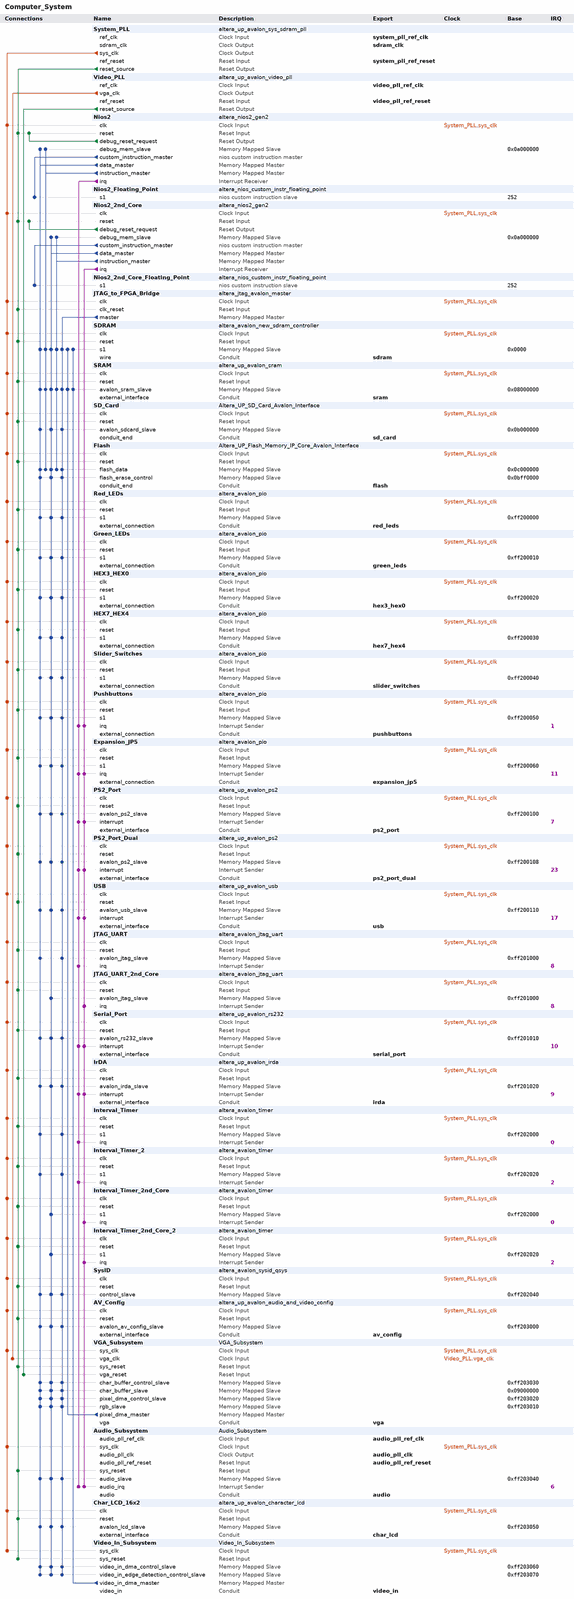
[diagram p0: system contents, whole]
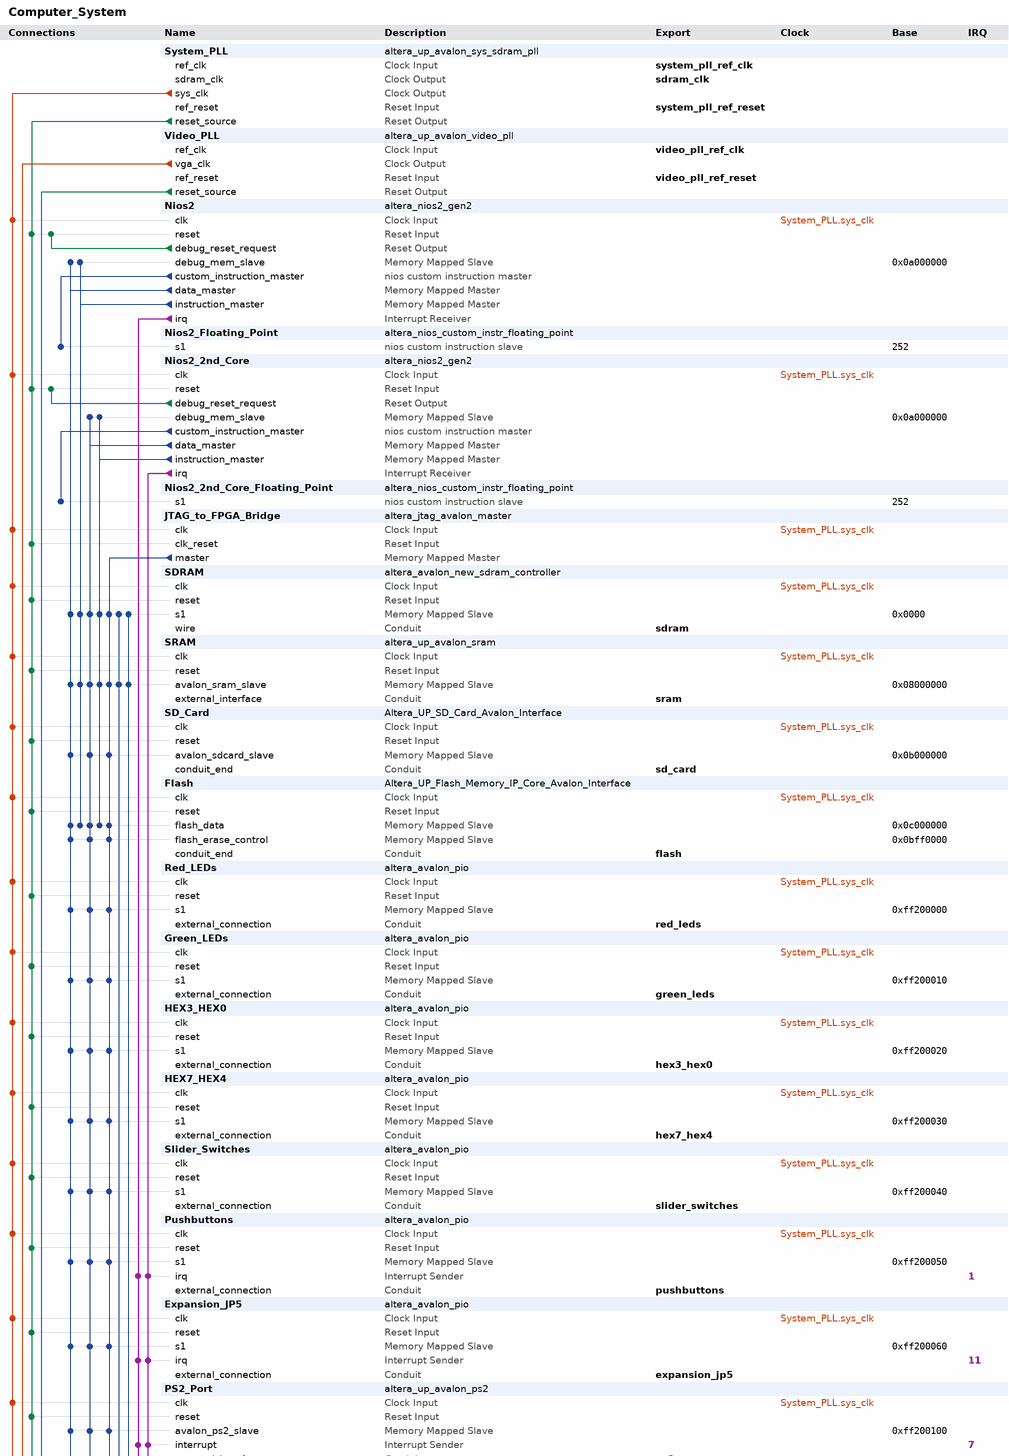
[diagram p1: system contents, upper part]
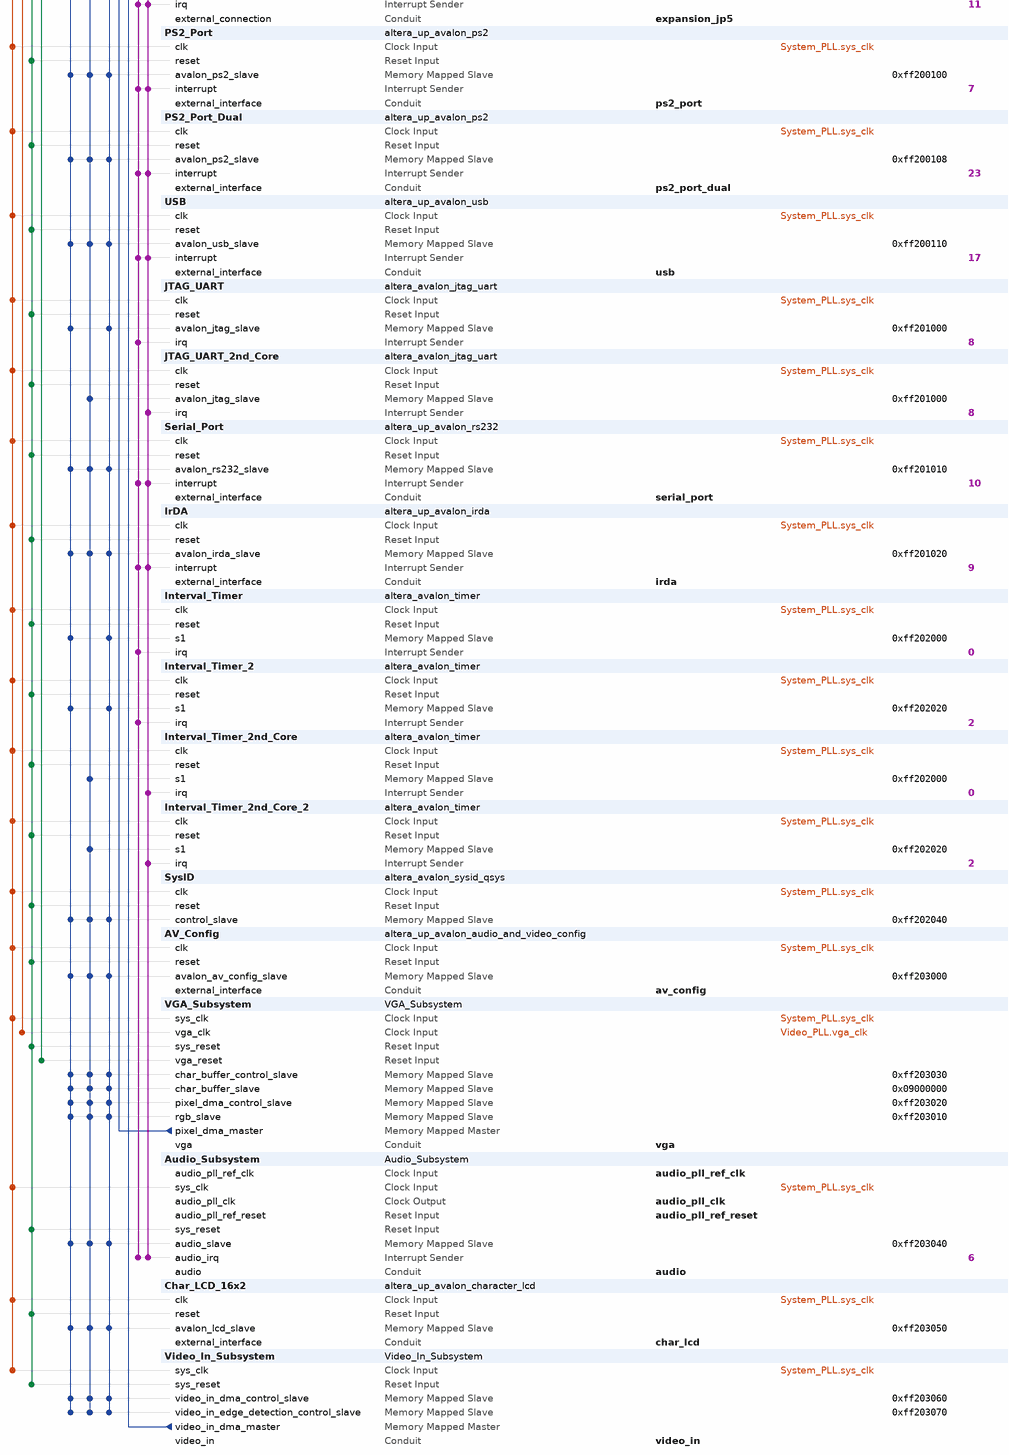
[diagram p2: system contents, lower part]
# Platform Designer (Qsys) system Computer_System, Cyclone IV E EP4CE115F29C8
# Parameters at their usual value, and those the tool derives, are not listed.
package require -exact qsys 18.0
create_system Computer_System
set_project_property DEVICE_FAMILY {Cyclone IV E}
set_project_property DEVICE EP4CE115F29C8

add_instance System_PLL altera_up_avalon_sys_sdram_pll 18.0
set_instance_parameter_value System_PLL CV_boards DE10-Standard
set_instance_parameter_value System_PLL gui_outclk 50.0
set_instance_parameter_value System_PLL gui_refclk 50.0

add_instance Video_PLL altera_up_avalon_video_pll 18.0
set_instance_parameter_value Video_PLL camera {5MP Digital Camera (THDB_D5M)}
set_instance_parameter_value Video_PLL gui_refclk 50.0
set_instance_parameter_value Video_PLL lcd {7" LCD on VEEK-MT and MTL/MTL2 Modules}

add_instance Nios2 altera_nios2_gen2 18.0
set_instance_parameter_value Nios2 dcache_size 0
set_instance_parameter_value Nios2 debug_datatrigger 2
set_instance_parameter_value Nios2 debug_hwbreakpoint 2
set_instance_parameter_value Nios2 debug_traceType instruction_trace
set_instance_parameter_value Nios2 dividerType srt2
set_instance_parameter_value Nios2 exceptionSlave SDRAM.s1
set_instance_parameter_value Nios2 icache_size 4096
set_instance_parameter_value Nios2 impl Fast
set_instance_parameter_value Nios2 mul_64_impl 1
set_instance_parameter_value Nios2 mul_shift_choice 1
set_instance_parameter_value Nios2 resetSlave SDRAM.s1
set_instance_parameter_value Nios2 resetrequest_enabled false
set_instance_parameter_value Nios2 setting_support31bitdcachebypass false

add_instance Nios2_Floating_Point altera_nios_custom_instr_floating_point 18.0

add_instance Nios2_2nd_Core altera_nios2_gen2 18.0
set_instance_parameter_value Nios2_2nd_Core cpuID 1
set_instance_parameter_value Nios2_2nd_Core dcache_size 0
set_instance_parameter_value Nios2_2nd_Core debug_datatrigger 2
set_instance_parameter_value Nios2_2nd_Core debug_hwbreakpoint 2
set_instance_parameter_value Nios2_2nd_Core debug_traceType instruction_trace
set_instance_parameter_value Nios2_2nd_Core dividerType srt2
set_instance_parameter_value Nios2_2nd_Core exceptionOffset 67108896
set_instance_parameter_value Nios2_2nd_Core exceptionSlave SDRAM.s1
set_instance_parameter_value Nios2_2nd_Core icache_size 4096
set_instance_parameter_value Nios2_2nd_Core impl Fast
set_instance_parameter_value Nios2_2nd_Core mul_64_impl 1
set_instance_parameter_value Nios2_2nd_Core mul_shift_choice 1
set_instance_parameter_value Nios2_2nd_Core resetOffset 67108864
set_instance_parameter_value Nios2_2nd_Core resetSlave SDRAM.s1
set_instance_parameter_value Nios2_2nd_Core resetrequest_enabled false
set_instance_parameter_value Nios2_2nd_Core setting_support31bitdcachebypass false

add_instance Nios2_2nd_Core_Floating_Point altera_nios_custom_instr_floating_point 18.0

add_instance JTAG_to_FPGA_Bridge altera_jtag_avalon_master 18.0

add_instance SDRAM altera_avalon_new_sdram_controller 18.0
set_instance_parameter_value SDRAM TAC 5.5
set_instance_parameter_value SDRAM TRCD 20.0
set_instance_parameter_value SDRAM TRP 20.0
set_instance_parameter_value SDRAM casLatency 3
set_instance_parameter_value SDRAM columnWidth 10
set_instance_parameter_value SDRAM dataWidth 32
set_instance_parameter_value SDRAM generateSimulationModel true
set_instance_parameter_value SDRAM model single_Micron_MT48LC4M32B2_7_chip
set_instance_parameter_value SDRAM numberOfBanks 4
set_instance_parameter_value SDRAM numberOfChipSelects 1
set_instance_parameter_value SDRAM powerUpDelay 100.0
set_instance_parameter_value SDRAM refreshPeriod 15.625
set_instance_parameter_value SDRAM rowWidth 13

add_instance SRAM altera_up_avalon_sram 18.0
set_instance_parameter_value SRAM board DE2-115
set_instance_parameter_value SRAM pixel_buffer true

add_instance SD_Card Altera_UP_SD_Card_Avalon_Interface 18.0

add_instance Flash Altera_UP_Flash_Memory_IP_Core_Avalon_Interface 18.0
set_instance_parameter_value Flash FLASH_MEMORY_ADDRESS_WIDTH 23

add_instance Red_LEDs altera_avalon_pio 18.0
set_instance_parameter_value Red_LEDs direction Output
set_instance_parameter_value Red_LEDs width 18

add_instance Green_LEDs altera_avalon_pio 18.0
set_instance_parameter_value Green_LEDs direction Output
set_instance_parameter_value Green_LEDs width 9

add_instance HEX3_HEX0 altera_avalon_pio 18.0
set_instance_parameter_value HEX3_HEX0 direction Output
set_instance_parameter_value HEX3_HEX0 width 32

add_instance HEX7_HEX4 altera_avalon_pio 18.0
set_instance_parameter_value HEX7_HEX4 direction Output
set_instance_parameter_value HEX7_HEX4 width 32

add_instance Slider_Switches altera_avalon_pio 18.0
set_instance_parameter_value Slider_Switches direction Input
set_instance_parameter_value Slider_Switches simDoTestBenchWiring true
set_instance_parameter_value Slider_Switches width 18

add_instance Pushbuttons altera_avalon_pio 18.0
set_instance_parameter_value Pushbuttons bitClearingEdgeCapReg true
set_instance_parameter_value Pushbuttons captureEdge true
set_instance_parameter_value Pushbuttons direction Input
set_instance_parameter_value Pushbuttons edgeType FALLING
set_instance_parameter_value Pushbuttons generateIRQ true
set_instance_parameter_value Pushbuttons irqType EDGE
set_instance_parameter_value Pushbuttons simDoTestBenchWiring true
set_instance_parameter_value Pushbuttons width 4

add_instance Expansion_JP5 altera_avalon_pio 18.0
set_instance_parameter_value Expansion_JP5 bitClearingEdgeCapReg true
set_instance_parameter_value Expansion_JP5 captureEdge true
set_instance_parameter_value Expansion_JP5 direction Bidir
set_instance_parameter_value Expansion_JP5 edgeType FALLING
set_instance_parameter_value Expansion_JP5 generateIRQ true
set_instance_parameter_value Expansion_JP5 irqType EDGE
set_instance_parameter_value Expansion_JP5 simDoTestBenchWiring true
set_instance_parameter_value Expansion_JP5 width 32

add_instance PS2_Port altera_up_avalon_ps2 18.0

add_instance PS2_Port_Dual altera_up_avalon_ps2 18.0

add_instance USB altera_up_avalon_usb 18.0

add_instance JTAG_UART altera_avalon_jtag_uart 18.0
set_instance_parameter_value JTAG_UART simInteractiveOptions NO_INTERACTIVE_WINDOWS

add_instance JTAG_UART_2nd_Core altera_avalon_jtag_uart 18.0
set_instance_parameter_value JTAG_UART_2nd_Core simInteractiveOptions NO_INTERACTIVE_WINDOWS

add_instance Serial_Port altera_up_avalon_rs232 17.1
set_instance_parameter_value Serial_Port baud 115200
set_instance_parameter_value Serial_Port parity Odd

add_instance IrDA altera_up_avalon_irda 18.0
set_instance_parameter_value IrDA baud 115200
set_instance_parameter_value IrDA parity None

add_instance Interval_Timer altera_avalon_timer 18.0
set_instance_parameter_value Interval_Timer period 125.0
set_instance_parameter_value Interval_Timer periodUnits MSEC

add_instance Interval_Timer_2 altera_avalon_timer 18.0
set_instance_parameter_value Interval_Timer_2 period 125.0
set_instance_parameter_value Interval_Timer_2 periodUnits MSEC

add_instance Interval_Timer_2nd_Core altera_avalon_timer 18.0
set_instance_parameter_value Interval_Timer_2nd_Core period 125.0
set_instance_parameter_value Interval_Timer_2nd_Core periodUnits MSEC

add_instance Interval_Timer_2nd_Core_2 altera_avalon_timer 18.0
set_instance_parameter_value Interval_Timer_2nd_Core_2 period 125.0
set_instance_parameter_value Interval_Timer_2nd_Core_2 periodUnits MSEC

add_instance SysID altera_avalon_sysid_qsys 18.0
set_instance_parameter_value SysID id 0

add_instance AV_Config altera_up_avalon_audio_and_video_config 18.0
set_instance_parameter_value AV_Config audio_in {Microphone to ADC}
set_instance_parameter_value AV_Config bit_length 32
set_instance_parameter_value AV_Config board DE2-115
set_instance_parameter_value AV_Config line_in_bypass true
set_instance_parameter_value AV_Config sampling_rate {8 kHz}

add_instance VGA_Subsystem VGA_Subsystem 1.0

add_instance Audio_Subsystem Audio_Subsystem 1.0

add_instance Char_LCD_16x2 altera_up_avalon_character_lcd 18.0
set_instance_parameter_value Char_LCD_16x2 cursor Both

add_instance Video_In_Subsystem Video_In_Subsystem 1.0

# connections
add_connection System_PLL.sys_clk Audio_Subsystem.sys_clk clock
add_connection System_PLL.sys_clk AV_Config.clk clock
add_connection System_PLL.sys_clk Char_LCD_16x2.clk clock
add_connection System_PLL.sys_clk Expansion_JP5.clk clock
add_connection System_PLL.sys_clk Flash.clk clock
add_connection System_PLL.sys_clk Green_LEDs.clk clock
add_connection System_PLL.sys_clk HEX3_HEX0.clk clock
add_connection System_PLL.sys_clk HEX7_HEX4.clk clock
add_connection System_PLL.sys_clk Interval_Timer.clk clock
add_connection System_PLL.sys_clk Interval_Timer_2.clk clock
add_connection System_PLL.sys_clk Interval_Timer_2nd_Core.clk clock
add_connection System_PLL.sys_clk Interval_Timer_2nd_Core_2.clk clock
add_connection System_PLL.sys_clk IrDA.clk clock
add_connection System_PLL.sys_clk JTAG_to_FPGA_Bridge.clk clock
add_connection System_PLL.sys_clk JTAG_UART.clk clock
add_connection System_PLL.sys_clk JTAG_UART_2nd_Core.clk clock
add_connection System_PLL.sys_clk Nios2.clk clock
add_connection System_PLL.sys_clk Nios2_2nd_Core.clk clock
add_connection System_PLL.sys_clk PS2_Port.clk clock
add_connection System_PLL.sys_clk PS2_Port_Dual.clk clock
add_connection System_PLL.sys_clk Pushbuttons.clk clock
add_connection System_PLL.sys_clk Red_LEDs.clk clock
add_connection System_PLL.sys_clk SD_Card.clk clock
add_connection System_PLL.sys_clk SDRAM.clk clock
add_connection System_PLL.sys_clk Serial_Port.clk clock
add_connection System_PLL.sys_clk Slider_Switches.clk clock
add_connection System_PLL.sys_clk SRAM.clk clock
add_connection System_PLL.sys_clk SysID.clk clock
add_connection System_PLL.sys_clk USB.clk clock
add_connection System_PLL.sys_clk VGA_Subsystem.sys_clk clock
add_connection System_PLL.sys_clk Video_In_Subsystem.sys_clk clock
add_connection Video_PLL.vga_clk VGA_Subsystem.vga_clk clock
add_connection Nios2.debug_reset_request Nios2.reset reset
add_connection Nios2_2nd_Core.debug_reset_request Nios2_2nd_Core.reset reset
add_connection System_PLL.reset_source Audio_Subsystem.sys_reset reset
add_connection System_PLL.reset_source AV_Config.reset reset
add_connection System_PLL.reset_source Char_LCD_16x2.reset reset
add_connection System_PLL.reset_source Expansion_JP5.reset reset
add_connection System_PLL.reset_source Flash.reset reset
add_connection System_PLL.reset_source Green_LEDs.reset reset
add_connection System_PLL.reset_source HEX3_HEX0.reset reset
add_connection System_PLL.reset_source HEX7_HEX4.reset reset
add_connection System_PLL.reset_source Interval_Timer.reset reset
add_connection System_PLL.reset_source Interval_Timer_2.reset reset
add_connection System_PLL.reset_source Interval_Timer_2nd_Core.reset reset
add_connection System_PLL.reset_source Interval_Timer_2nd_Core_2.reset reset
add_connection System_PLL.reset_source IrDA.reset reset
add_connection System_PLL.reset_source JTAG_to_FPGA_Bridge.clk_reset reset
add_connection System_PLL.reset_source JTAG_UART.reset reset
add_connection System_PLL.reset_source JTAG_UART_2nd_Core.reset reset
add_connection System_PLL.reset_source Nios2.reset reset
add_connection System_PLL.reset_source Nios2_2nd_Core.reset reset
add_connection System_PLL.reset_source PS2_Port.reset reset
add_connection System_PLL.reset_source PS2_Port_Dual.reset reset
add_connection System_PLL.reset_source Pushbuttons.reset reset
add_connection System_PLL.reset_source Red_LEDs.reset reset
add_connection System_PLL.reset_source SD_Card.reset reset
add_connection System_PLL.reset_source SDRAM.reset reset
add_connection System_PLL.reset_source Serial_Port.reset reset
add_connection System_PLL.reset_source Slider_Switches.reset reset
add_connection System_PLL.reset_source SRAM.reset reset
add_connection System_PLL.reset_source SysID.reset reset
add_connection System_PLL.reset_source USB.reset reset
add_connection System_PLL.reset_source VGA_Subsystem.sys_reset reset
add_connection System_PLL.reset_source Video_In_Subsystem.sys_reset reset
add_connection Video_PLL.reset_source VGA_Subsystem.vga_reset reset
add_connection JTAG_to_FPGA_Bridge.master Audio_Subsystem.audio_slave avalon
set_connection_parameter_value JTAG_to_FPGA_Bridge.master/Audio_Subsystem.audio_slave baseAddress 0xff203040
add_connection JTAG_to_FPGA_Bridge.master AV_Config.avalon_av_config_slave avalon
set_connection_parameter_value JTAG_to_FPGA_Bridge.master/AV_Config.avalon_av_config_slave baseAddress 0xff203000
add_connection JTAG_to_FPGA_Bridge.master Char_LCD_16x2.avalon_lcd_slave avalon
set_connection_parameter_value JTAG_to_FPGA_Bridge.master/Char_LCD_16x2.avalon_lcd_slave baseAddress 0xff203050
add_connection JTAG_to_FPGA_Bridge.master Expansion_JP5.s1 avalon
set_connection_parameter_value JTAG_to_FPGA_Bridge.master/Expansion_JP5.s1 baseAddress 0xff200060
add_connection JTAG_to_FPGA_Bridge.master Flash.flash_data avalon
set_connection_parameter_value JTAG_to_FPGA_Bridge.master/Flash.flash_data baseAddress 0x0c000000
add_connection JTAG_to_FPGA_Bridge.master Flash.flash_erase_control avalon
set_connection_parameter_value JTAG_to_FPGA_Bridge.master/Flash.flash_erase_control baseAddress 0x0bff0000
add_connection JTAG_to_FPGA_Bridge.master Green_LEDs.s1 avalon
set_connection_parameter_value JTAG_to_FPGA_Bridge.master/Green_LEDs.s1 baseAddress 0xff200010
add_connection JTAG_to_FPGA_Bridge.master HEX3_HEX0.s1 avalon
set_connection_parameter_value JTAG_to_FPGA_Bridge.master/HEX3_HEX0.s1 baseAddress 0xff200020
add_connection JTAG_to_FPGA_Bridge.master HEX7_HEX4.s1 avalon
set_connection_parameter_value JTAG_to_FPGA_Bridge.master/HEX7_HEX4.s1 baseAddress 0xff200030
add_connection JTAG_to_FPGA_Bridge.master Interval_Timer.s1 avalon
set_connection_parameter_value JTAG_to_FPGA_Bridge.master/Interval_Timer.s1 baseAddress 0xff202000
add_connection JTAG_to_FPGA_Bridge.master Interval_Timer_2.s1 avalon
set_connection_parameter_value JTAG_to_FPGA_Bridge.master/Interval_Timer_2.s1 baseAddress 0xff202020
add_connection JTAG_to_FPGA_Bridge.master IrDA.avalon_irda_slave avalon
set_connection_parameter_value JTAG_to_FPGA_Bridge.master/IrDA.avalon_irda_slave baseAddress 0xff201020
add_connection JTAG_to_FPGA_Bridge.master JTAG_UART.avalon_jtag_slave avalon
set_connection_parameter_value JTAG_to_FPGA_Bridge.master/JTAG_UART.avalon_jtag_slave baseAddress 0xff201000
add_connection JTAG_to_FPGA_Bridge.master PS2_Port.avalon_ps2_slave avalon
set_connection_parameter_value JTAG_to_FPGA_Bridge.master/PS2_Port.avalon_ps2_slave baseAddress 0xff200100
add_connection JTAG_to_FPGA_Bridge.master PS2_Port_Dual.avalon_ps2_slave avalon
set_connection_parameter_value JTAG_to_FPGA_Bridge.master/PS2_Port_Dual.avalon_ps2_slave baseAddress 0xff200108
add_connection JTAG_to_FPGA_Bridge.master Pushbuttons.s1 avalon
set_connection_parameter_value JTAG_to_FPGA_Bridge.master/Pushbuttons.s1 baseAddress 0xff200050
add_connection JTAG_to_FPGA_Bridge.master Red_LEDs.s1 avalon
set_connection_parameter_value JTAG_to_FPGA_Bridge.master/Red_LEDs.s1 baseAddress 0xff200000
add_connection JTAG_to_FPGA_Bridge.master SD_Card.avalon_sdcard_slave avalon
set_connection_parameter_value JTAG_to_FPGA_Bridge.master/SD_Card.avalon_sdcard_slave baseAddress 0x0b000000
add_connection JTAG_to_FPGA_Bridge.master SDRAM.s1 avalon
set_connection_parameter_value JTAG_to_FPGA_Bridge.master/SDRAM.s1 baseAddress 0x0000
add_connection JTAG_to_FPGA_Bridge.master Serial_Port.avalon_rs232_slave avalon
set_connection_parameter_value JTAG_to_FPGA_Bridge.master/Serial_Port.avalon_rs232_slave baseAddress 0xff201010
add_connection JTAG_to_FPGA_Bridge.master Slider_Switches.s1 avalon
set_connection_parameter_value JTAG_to_FPGA_Bridge.master/Slider_Switches.s1 baseAddress 0xff200040
add_connection JTAG_to_FPGA_Bridge.master SRAM.avalon_sram_slave avalon
set_connection_parameter_value JTAG_to_FPGA_Bridge.master/SRAM.avalon_sram_slave baseAddress 0x08000000
add_connection JTAG_to_FPGA_Bridge.master SysID.control_slave avalon
set_connection_parameter_value JTAG_to_FPGA_Bridge.master/SysID.control_slave baseAddress 0xff202040
add_connection JTAG_to_FPGA_Bridge.master USB.avalon_usb_slave avalon
set_connection_parameter_value JTAG_to_FPGA_Bridge.master/USB.avalon_usb_slave baseAddress 0xff200110
add_connection JTAG_to_FPGA_Bridge.master VGA_Subsystem.char_buffer_control_slave avalon
set_connection_parameter_value JTAG_to_FPGA_Bridge.master/VGA_Subsystem.char_buffer_control_slave baseAddress 0xff203030
add_connection JTAG_to_FPGA_Bridge.master VGA_Subsystem.char_buffer_slave avalon
set_connection_parameter_value JTAG_to_FPGA_Bridge.master/VGA_Subsystem.char_buffer_slave baseAddress 0x09000000
add_connection JTAG_to_FPGA_Bridge.master VGA_Subsystem.pixel_dma_control_slave avalon
set_connection_parameter_value JTAG_to_FPGA_Bridge.master/VGA_Subsystem.pixel_dma_control_slave baseAddress 0xff203020
add_connection JTAG_to_FPGA_Bridge.master VGA_Subsystem.rgb_slave avalon
set_connection_parameter_value JTAG_to_FPGA_Bridge.master/VGA_Subsystem.rgb_slave baseAddress 0xff203010
add_connection JTAG_to_FPGA_Bridge.master Video_In_Subsystem.video_in_dma_control_slave avalon
set_connection_parameter_value JTAG_to_FPGA_Bridge.master/Video_In_Subsystem.video_in_dma_control_slave baseAddress 0xff203060
add_connection JTAG_to_FPGA_Bridge.master Video_In_Subsystem.video_in_edge_detection_control_slave avalon
set_connection_parameter_value JTAG_to_FPGA_Bridge.master/Video_In_Subsystem.video_in_edge_detection_control_slave baseAddress 0xff203070
add_connection Nios2.data_master Audio_Subsystem.audio_slave avalon
set_connection_parameter_value Nios2.data_master/Audio_Subsystem.audio_slave baseAddress 0xff203040
add_connection Nios2.data_master AV_Config.avalon_av_config_slave avalon
set_connection_parameter_value Nios2.data_master/AV_Config.avalon_av_config_slave baseAddress 0xff203000
add_connection Nios2.data_master Char_LCD_16x2.avalon_lcd_slave avalon
set_connection_parameter_value Nios2.data_master/Char_LCD_16x2.avalon_lcd_slave baseAddress 0xff203050
add_connection Nios2.data_master Expansion_JP5.s1 avalon
set_connection_parameter_value Nios2.data_master/Expansion_JP5.s1 baseAddress 0xff200060
add_connection Nios2.data_master Flash.flash_data avalon
set_connection_parameter_value Nios2.data_master/Flash.flash_data baseAddress 0x0c000000
add_connection Nios2.data_master Flash.flash_erase_control avalon
set_connection_parameter_value Nios2.data_master/Flash.flash_erase_control baseAddress 0x0bff0000
add_connection Nios2.data_master Green_LEDs.s1 avalon
set_connection_parameter_value Nios2.data_master/Green_LEDs.s1 baseAddress 0xff200010
add_connection Nios2.data_master HEX3_HEX0.s1 avalon
set_connection_parameter_value Nios2.data_master/HEX3_HEX0.s1 baseAddress 0xff200020
add_connection Nios2.data_master HEX7_HEX4.s1 avalon
set_connection_parameter_value Nios2.data_master/HEX7_HEX4.s1 baseAddress 0xff200030
add_connection Nios2.data_master Interval_Timer.s1 avalon
set_connection_parameter_value Nios2.data_master/Interval_Timer.s1 baseAddress 0xff202000
add_connection Nios2.data_master Interval_Timer_2.s1 avalon
set_connection_parameter_value Nios2.data_master/Interval_Timer_2.s1 baseAddress 0xff202020
add_connection Nios2.data_master IrDA.avalon_irda_slave avalon
set_connection_parameter_value Nios2.data_master/IrDA.avalon_irda_slave baseAddress 0xff201020
add_connection Nios2.data_master JTAG_UART.avalon_jtag_slave avalon
set_connection_parameter_value Nios2.data_master/JTAG_UART.avalon_jtag_slave baseAddress 0xff201000
add_connection Nios2.data_master Nios2.debug_mem_slave avalon
set_connection_parameter_value Nios2.data_master/Nios2.debug_mem_slave baseAddress 0x0a000000
add_connection Nios2.data_master PS2_Port.avalon_ps2_slave avalon
set_connection_parameter_value Nios2.data_master/PS2_Port.avalon_ps2_slave baseAddress 0xff200100
add_connection Nios2.data_master PS2_Port_Dual.avalon_ps2_slave avalon
set_connection_parameter_value Nios2.data_master/PS2_Port_Dual.avalon_ps2_slave baseAddress 0xff200108
add_connection Nios2.data_master Pushbuttons.s1 avalon
set_connection_parameter_value Nios2.data_master/Pushbuttons.s1 baseAddress 0xff200050
add_connection Nios2.data_master Red_LEDs.s1 avalon
set_connection_parameter_value Nios2.data_master/Red_LEDs.s1 baseAddress 0xff200000
add_connection Nios2.data_master SD_Card.avalon_sdcard_slave avalon
set_connection_parameter_value Nios2.data_master/SD_Card.avalon_sdcard_slave baseAddress 0x0b000000
add_connection Nios2.data_master SDRAM.s1 avalon
set_connection_parameter_value Nios2.data_master/SDRAM.s1 baseAddress 0x0000
add_connection Nios2.data_master Serial_Port.avalon_rs232_slave avalon
set_connection_parameter_value Nios2.data_master/Serial_Port.avalon_rs232_slave baseAddress 0xff201010
add_connection Nios2.data_master Slider_Switches.s1 avalon
set_connection_parameter_value Nios2.data_master/Slider_Switches.s1 baseAddress 0xff200040
add_connection Nios2.data_master SRAM.avalon_sram_slave avalon
set_connection_parameter_value Nios2.data_master/SRAM.avalon_sram_slave baseAddress 0x08000000
add_connection Nios2.data_master SysID.control_slave avalon
set_connection_parameter_value Nios2.data_master/SysID.control_slave baseAddress 0xff202040
add_connection Nios2.data_master USB.avalon_usb_slave avalon
set_connection_parameter_value Nios2.data_master/USB.avalon_usb_slave baseAddress 0xff200110
add_connection Nios2.data_master VGA_Subsystem.char_buffer_control_slave avalon
set_connection_parameter_value Nios2.data_master/VGA_Subsystem.char_buffer_control_slave baseAddress 0xff203030
add_connection Nios2.data_master VGA_Subsystem.char_buffer_slave avalon
set_connection_parameter_value Nios2.data_master/VGA_Subsystem.char_buffer_slave baseAddress 0x09000000
add_connection Nios2.data_master VGA_Subsystem.pixel_dma_control_slave avalon
set_connection_parameter_value Nios2.data_master/VGA_Subsystem.pixel_dma_control_slave baseAddress 0xff203020
add_connection Nios2.data_master VGA_Subsystem.rgb_slave avalon
set_connection_parameter_value Nios2.data_master/VGA_Subsystem.rgb_slave baseAddress 0xff203010
add_connection Nios2.data_master Video_In_Subsystem.video_in_dma_control_slave avalon
set_connection_parameter_value Nios2.data_master/Video_In_Subsystem.video_in_dma_control_slave baseAddress 0xff203060
add_connection Nios2.data_master Video_In_Subsystem.video_in_edge_detection_control_slave avalon
set_connection_parameter_value Nios2.data_master/Video_In_Subsystem.video_in_edge_detection_control_slave baseAddress 0xff203070
add_connection Nios2.instruction_master Flash.flash_data avalon
set_connection_parameter_value Nios2.instruction_master/Flash.flash_data baseAddress 0x0c000000
add_connection Nios2.instruction_master Nios2.debug_mem_slave avalon
set_connection_parameter_value Nios2.instruction_master/Nios2.debug_mem_slave baseAddress 0x0a000000
add_connection Nios2.instruction_master SDRAM.s1 avalon
set_connection_parameter_value Nios2.instruction_master/SDRAM.s1 baseAddress 0x0000
add_connection Nios2.instruction_master SRAM.avalon_sram_slave avalon
set_connection_parameter_value Nios2.instruction_master/SRAM.avalon_sram_slave baseAddress 0x08000000
add_connection Nios2_2nd_Core.data_master Audio_Subsystem.audio_slave avalon
set_connection_parameter_value Nios2_2nd_Core.data_master/Audio_Subsystem.audio_slave baseAddress 0xff203040
add_connection Nios2_2nd_Core.data_master AV_Config.avalon_av_config_slave avalon
set_connection_parameter_value Nios2_2nd_Core.data_master/AV_Config.avalon_av_config_slave baseAddress 0xff203000
add_connection Nios2_2nd_Core.data_master Char_LCD_16x2.avalon_lcd_slave avalon
set_connection_parameter_value Nios2_2nd_Core.data_master/Char_LCD_16x2.avalon_lcd_slave baseAddress 0xff203050
add_connection Nios2_2nd_Core.data_master Expansion_JP5.s1 avalon
set_connection_parameter_value Nios2_2nd_Core.data_master/Expansion_JP5.s1 baseAddress 0xff200060
add_connection Nios2_2nd_Core.data_master Flash.flash_data avalon
set_connection_parameter_value Nios2_2nd_Core.data_master/Flash.flash_data baseAddress 0x0c000000
add_connection Nios2_2nd_Core.data_master Flash.flash_erase_control avalon
set_connection_parameter_value Nios2_2nd_Core.data_master/Flash.flash_erase_control baseAddress 0x0bff0000
add_connection Nios2_2nd_Core.data_master Green_LEDs.s1 avalon
set_connection_parameter_value Nios2_2nd_Core.data_master/Green_LEDs.s1 baseAddress 0xff200010
add_connection Nios2_2nd_Core.data_master HEX3_HEX0.s1 avalon
set_connection_parameter_value Nios2_2nd_Core.data_master/HEX3_HEX0.s1 baseAddress 0xff200020
add_connection Nios2_2nd_Core.data_master HEX7_HEX4.s1 avalon
set_connection_parameter_value Nios2_2nd_Core.data_master/HEX7_HEX4.s1 baseAddress 0xff200030
add_connection Nios2_2nd_Core.data_master Interval_Timer_2nd_Core.s1 avalon
set_connection_parameter_value Nios2_2nd_Core.data_master/Interval_Timer_2nd_Core.s1 baseAddress 0xff202000
add_connection Nios2_2nd_Core.data_master Interval_Timer_2nd_Core_2.s1 avalon
set_connection_parameter_value Nios2_2nd_Core.data_master/Interval_Timer_2nd_Core_2.s1 baseAddress 0xff202020
add_connection Nios2_2nd_Core.data_master IrDA.avalon_irda_slave avalon
set_connection_parameter_value Nios2_2nd_Core.data_master/IrDA.avalon_irda_slave baseAddress 0xff201020
add_connection Nios2_2nd_Core.data_master JTAG_UART_2nd_Core.avalon_jtag_slave avalon
set_connection_parameter_value Nios2_2nd_Core.data_master/JTAG_UART_2nd_Core.avalon_jtag_slave baseAddress 0xff201000
add_connection Nios2_2nd_Core.data_master Nios2_2nd_Core.debug_mem_slave avalon
set_connection_parameter_value Nios2_2nd_Core.data_master/Nios2_2nd_Core.debug_mem_slave baseAddress 0x0a000000
add_connection Nios2_2nd_Core.data_master PS2_Port.avalon_ps2_slave avalon
set_connection_parameter_value Nios2_2nd_Core.data_master/PS2_Port.avalon_ps2_slave baseAddress 0xff200100
add_connection Nios2_2nd_Core.data_master PS2_Port_Dual.avalon_ps2_slave avalon
set_connection_parameter_value Nios2_2nd_Core.data_master/PS2_Port_Dual.avalon_ps2_slave baseAddress 0xff200108
add_connection Nios2_2nd_Core.data_master Pushbuttons.s1 avalon
set_connection_parameter_value Nios2_2nd_Core.data_master/Pushbuttons.s1 baseAddress 0xff200050
add_connection Nios2_2nd_Core.data_master Red_LEDs.s1 avalon
set_connection_parameter_value Nios2_2nd_Core.data_master/Red_LEDs.s1 baseAddress 0xff200000
add_connection Nios2_2nd_Core.data_master SD_Card.avalon_sdcard_slave avalon
set_connection_parameter_value Nios2_2nd_Core.data_master/SD_Card.avalon_sdcard_slave baseAddress 0x0b000000
add_connection Nios2_2nd_Core.data_master SDRAM.s1 avalon
set_connection_parameter_value Nios2_2nd_Core.data_master/SDRAM.s1 baseAddress 0x0000
add_connection Nios2_2nd_Core.data_master Serial_Port.avalon_rs232_slave avalon
set_connection_parameter_value Nios2_2nd_Core.data_master/Serial_Port.avalon_rs232_slave baseAddress 0xff201010
add_connection Nios2_2nd_Core.data_master Slider_Switches.s1 avalon
set_connection_parameter_value Nios2_2nd_Core.data_master/Slider_Switches.s1 baseAddress 0xff200040
add_connection Nios2_2nd_Core.data_master SRAM.avalon_sram_slave avalon
set_connection_parameter_value Nios2_2nd_Core.data_master/SRAM.avalon_sram_slave baseAddress 0x08000000
add_connection Nios2_2nd_Core.data_master SysID.control_slave avalon
set_connection_parameter_value Nios2_2nd_Core.data_master/SysID.control_slave baseAddress 0xff202040
add_connection Nios2_2nd_Core.data_master USB.avalon_usb_slave avalon
set_connection_parameter_value Nios2_2nd_Core.data_master/USB.avalon_usb_slave baseAddress 0xff200110
add_connection Nios2_2nd_Core.data_master VGA_Subsystem.char_buffer_control_slave avalon
set_connection_parameter_value Nios2_2nd_Core.data_master/VGA_Subsystem.char_buffer_control_slave baseAddress 0xff203030
add_connection Nios2_2nd_Core.data_master VGA_Subsystem.char_buffer_slave avalon
set_connection_parameter_value Nios2_2nd_Core.data_master/VGA_Subsystem.char_buffer_slave baseAddress 0x09000000
add_connection Nios2_2nd_Core.data_master VGA_Subsystem.pixel_dma_control_slave avalon
set_connection_parameter_value Nios2_2nd_Core.data_master/VGA_Subsystem.pixel_dma_control_slave baseAddress 0xff203020
add_connection Nios2_2nd_Core.data_master VGA_Subsystem.rgb_slave avalon
set_connection_parameter_value Nios2_2nd_Core.data_master/VGA_Subsystem.rgb_slave baseAddress 0xff203010
add_connection Nios2_2nd_Core.data_master Video_In_Subsystem.video_in_dma_control_slave avalon
set_connection_parameter_value Nios2_2nd_Core.data_master/Video_In_Subsystem.video_in_dma_control_slave baseAddress 0xff203060
add_connection Nios2_2nd_Core.data_master Video_In_Subsystem.video_in_edge_detection_control_slave avalon
set_connection_parameter_value Nios2_2nd_Core.data_master/Video_In_Subsystem.video_in_edge_detection_control_slave baseAddress 0xff203070
add_connection Nios2_2nd_Core.instruction_master Flash.flash_data avalon
set_connection_parameter_value Nios2_2nd_Core.instruction_master/Flash.flash_data baseAddress 0x0c000000
add_connection Nios2_2nd_Core.instruction_master Nios2_2nd_Core.debug_mem_slave avalon
set_connection_parameter_value Nios2_2nd_Core.instruction_master/Nios2_2nd_Core.debug_mem_slave baseAddress 0x0a000000
add_connection Nios2_2nd_Core.instruction_master SDRAM.s1 avalon
set_connection_parameter_value Nios2_2nd_Core.instruction_master/SDRAM.s1 baseAddress 0x0000
add_connection Nios2_2nd_Core.instruction_master SRAM.avalon_sram_slave avalon
set_connection_parameter_value Nios2_2nd_Core.instruction_master/SRAM.avalon_sram_slave baseAddress 0x08000000
add_connection VGA_Subsystem.pixel_dma_master SDRAM.s1 avalon
set_connection_parameter_value VGA_Subsystem.pixel_dma_master/SDRAM.s1 baseAddress 0x0000
add_connection VGA_Subsystem.pixel_dma_master SRAM.avalon_sram_slave avalon
set_connection_parameter_value VGA_Subsystem.pixel_dma_master/SRAM.avalon_sram_slave baseAddress 0x08000000
add_connection Video_In_Subsystem.video_in_dma_master SDRAM.s1 avalon
set_connection_parameter_value Video_In_Subsystem.video_in_dma_master/SDRAM.s1 baseAddress 0x0000
add_connection Video_In_Subsystem.video_in_dma_master SRAM.avalon_sram_slave avalon
set_connection_parameter_value Video_In_Subsystem.video_in_dma_master/SRAM.avalon_sram_slave baseAddress 0x08000000
add_connection Nios2.irq Audio_Subsystem.audio_irq interrupt
set_connection_parameter_value Nios2.irq/Audio_Subsystem.audio_irq irqNumber 6
add_connection Nios2.irq Expansion_JP5.irq interrupt
set_connection_parameter_value Nios2.irq/Expansion_JP5.irq irqNumber 11
add_connection Nios2.irq Interval_Timer.irq interrupt
set_connection_parameter_value Nios2.irq/Interval_Timer.irq irqNumber 0
add_connection Nios2.irq Interval_Timer_2.irq interrupt
set_connection_parameter_value Nios2.irq/Interval_Timer_2.irq irqNumber 2
add_connection Nios2.irq IrDA.interrupt interrupt
set_connection_parameter_value Nios2.irq/IrDA.interrupt irqNumber 9
add_connection Nios2.irq JTAG_UART.irq interrupt
set_connection_parameter_value Nios2.irq/JTAG_UART.irq irqNumber 8
add_connection Nios2.irq PS2_Port.interrupt interrupt
set_connection_parameter_value Nios2.irq/PS2_Port.interrupt irqNumber 7
add_connection Nios2.irq PS2_Port_Dual.interrupt interrupt
set_connection_parameter_value Nios2.irq/PS2_Port_Dual.interrupt irqNumber 23
add_connection Nios2.irq Pushbuttons.irq interrupt
set_connection_parameter_value Nios2.irq/Pushbuttons.irq irqNumber 1
add_connection Nios2.irq Serial_Port.interrupt interrupt
set_connection_parameter_value Nios2.irq/Serial_Port.interrupt irqNumber 10
add_connection Nios2.irq USB.interrupt interrupt
set_connection_parameter_value Nios2.irq/USB.interrupt irqNumber 17
add_connection Nios2_2nd_Core.irq Audio_Subsystem.audio_irq interrupt
set_connection_parameter_value Nios2_2nd_Core.irq/Audio_Subsystem.audio_irq irqNumber 6
add_connection Nios2_2nd_Core.irq Expansion_JP5.irq interrupt
set_connection_parameter_value Nios2_2nd_Core.irq/Expansion_JP5.irq irqNumber 11
add_connection Nios2_2nd_Core.irq Interval_Timer_2nd_Core.irq interrupt
set_connection_parameter_value Nios2_2nd_Core.irq/Interval_Timer_2nd_Core.irq irqNumber 0
add_connection Nios2_2nd_Core.irq Interval_Timer_2nd_Core_2.irq interrupt
set_connection_parameter_value Nios2_2nd_Core.irq/Interval_Timer_2nd_Core_2.irq irqNumber 2
add_connection Nios2_2nd_Core.irq IrDA.interrupt interrupt
set_connection_parameter_value Nios2_2nd_Core.irq/IrDA.interrupt irqNumber 9
add_connection Nios2_2nd_Core.irq JTAG_UART_2nd_Core.irq interrupt
set_connection_parameter_value Nios2_2nd_Core.irq/JTAG_UART_2nd_Core.irq irqNumber 8
add_connection Nios2_2nd_Core.irq PS2_Port.interrupt interrupt
set_connection_parameter_value Nios2_2nd_Core.irq/PS2_Port.interrupt irqNumber 7
add_connection Nios2_2nd_Core.irq PS2_Port_Dual.interrupt interrupt
set_connection_parameter_value Nios2_2nd_Core.irq/PS2_Port_Dual.interrupt irqNumber 23
add_connection Nios2_2nd_Core.irq Pushbuttons.irq interrupt
set_connection_parameter_value Nios2_2nd_Core.irq/Pushbuttons.irq irqNumber 1
add_connection Nios2_2nd_Core.irq Serial_Port.interrupt interrupt
set_connection_parameter_value Nios2_2nd_Core.irq/Serial_Port.interrupt irqNumber 10
add_connection Nios2_2nd_Core.irq USB.interrupt interrupt
set_connection_parameter_value Nios2_2nd_Core.irq/USB.interrupt irqNumber 17
add_connection Nios2.custom_instruction_master Nios2_Floating_Point.s1 nios_custom_instruction
set_connection_parameter_value Nios2.custom_instruction_master/Nios2_Floating_Point.s1 CIName nios2_floating_point
set_connection_parameter_value Nios2.custom_instruction_master/Nios2_Floating_Point.s1 baseAddress 252
add_connection Nios2_2nd_Core.custom_instruction_master Nios2_2nd_Core_Floating_Point.s1 nios_custom_instruction
set_connection_parameter_value Nios2_2nd_Core.custom_instruction_master/Nios2_2nd_Core_Floating_Point.s1 CIName nios2_2nd_core_floating_point
set_connection_parameter_value Nios2_2nd_Core.custom_instruction_master/Nios2_2nd_Core_Floating_Point.s1 baseAddress 252

# exported interfaces
add_interface audio conduit end
set_interface_property audio EXPORT_OF Audio_Subsystem.audio
add_interface audio_pll_clk clock source
set_interface_property audio_pll_clk EXPORT_OF Audio_Subsystem.audio_pll_clk
add_interface audio_pll_ref_clk clock sink
set_interface_property audio_pll_ref_clk EXPORT_OF Audio_Subsystem.audio_pll_ref_clk
add_interface audio_pll_ref_reset reset sink
set_interface_property audio_pll_ref_reset EXPORT_OF Audio_Subsystem.audio_pll_ref_reset
add_interface av_config conduit end
set_interface_property av_config EXPORT_OF AV_Config.external_interface
add_interface char_lcd conduit end
set_interface_property char_lcd EXPORT_OF Char_LCD_16x2.external_interface
add_interface expansion_jp5 conduit end
set_interface_property expansion_jp5 EXPORT_OF Expansion_JP5.external_connection
add_interface flash conduit end
set_interface_property flash EXPORT_OF Flash.conduit_end
add_interface green_leds conduit end
set_interface_property green_leds EXPORT_OF Green_LEDs.external_connection
add_interface hex3_hex0 conduit end
set_interface_property hex3_hex0 EXPORT_OF HEX3_HEX0.external_connection
add_interface hex7_hex4 conduit end
set_interface_property hex7_hex4 EXPORT_OF HEX7_HEX4.external_connection
add_interface irda conduit end
set_interface_property irda EXPORT_OF IrDA.external_interface
add_interface ps2_port conduit end
set_interface_property ps2_port EXPORT_OF PS2_Port.external_interface
add_interface ps2_port_dual conduit end
set_interface_property ps2_port_dual EXPORT_OF PS2_Port_Dual.external_interface
add_interface pushbuttons conduit end
set_interface_property pushbuttons EXPORT_OF Pushbuttons.external_connection
add_interface red_leds conduit end
set_interface_property red_leds EXPORT_OF Red_LEDs.external_connection
add_interface sd_card conduit end
set_interface_property sd_card EXPORT_OF SD_Card.conduit_end
add_interface sdram conduit end
set_interface_property sdram EXPORT_OF SDRAM.wire
add_interface sdram_clk clock source
set_interface_property sdram_clk EXPORT_OF System_PLL.sdram_clk
add_interface serial_port conduit end
set_interface_property serial_port EXPORT_OF Serial_Port.external_interface
add_interface slider_switches conduit end
set_interface_property slider_switches EXPORT_OF Slider_Switches.external_connection
add_interface sram conduit end
set_interface_property sram EXPORT_OF SRAM.external_interface
add_interface system_pll_ref_clk clock sink
set_interface_property system_pll_ref_clk EXPORT_OF System_PLL.ref_clk
add_interface system_pll_ref_reset reset sink
set_interface_property system_pll_ref_reset EXPORT_OF System_PLL.ref_reset
add_interface usb conduit end
set_interface_property usb EXPORT_OF USB.external_interface
add_interface vga conduit end
set_interface_property vga EXPORT_OF VGA_Subsystem.vga
add_interface video_in conduit end
set_interface_property video_in EXPORT_OF Video_In_Subsystem.video_in
add_interface video_pll_ref_clk clock sink
set_interface_property video_pll_ref_clk EXPORT_OF Video_PLL.ref_clk
add_interface video_pll_ref_reset reset sink
set_interface_property video_pll_ref_reset EXPORT_OF Video_PLL.ref_reset

set_interconnect_requirement {$system} qsys_mm.clockCrossingAdapter HANDSHAKE
set_interconnect_requirement {$system} qsys_mm.enableEccProtection FALSE
set_interconnect_requirement {$system} qsys_mm.insertDefaultSlave FALSE
set_interconnect_requirement {$system} qsys_mm.maxAdditionalLatency 1

save_system Computer_System.qsys
